# EAGLE schematic DUT-28bit-preCounter (EAGLE 5.07)
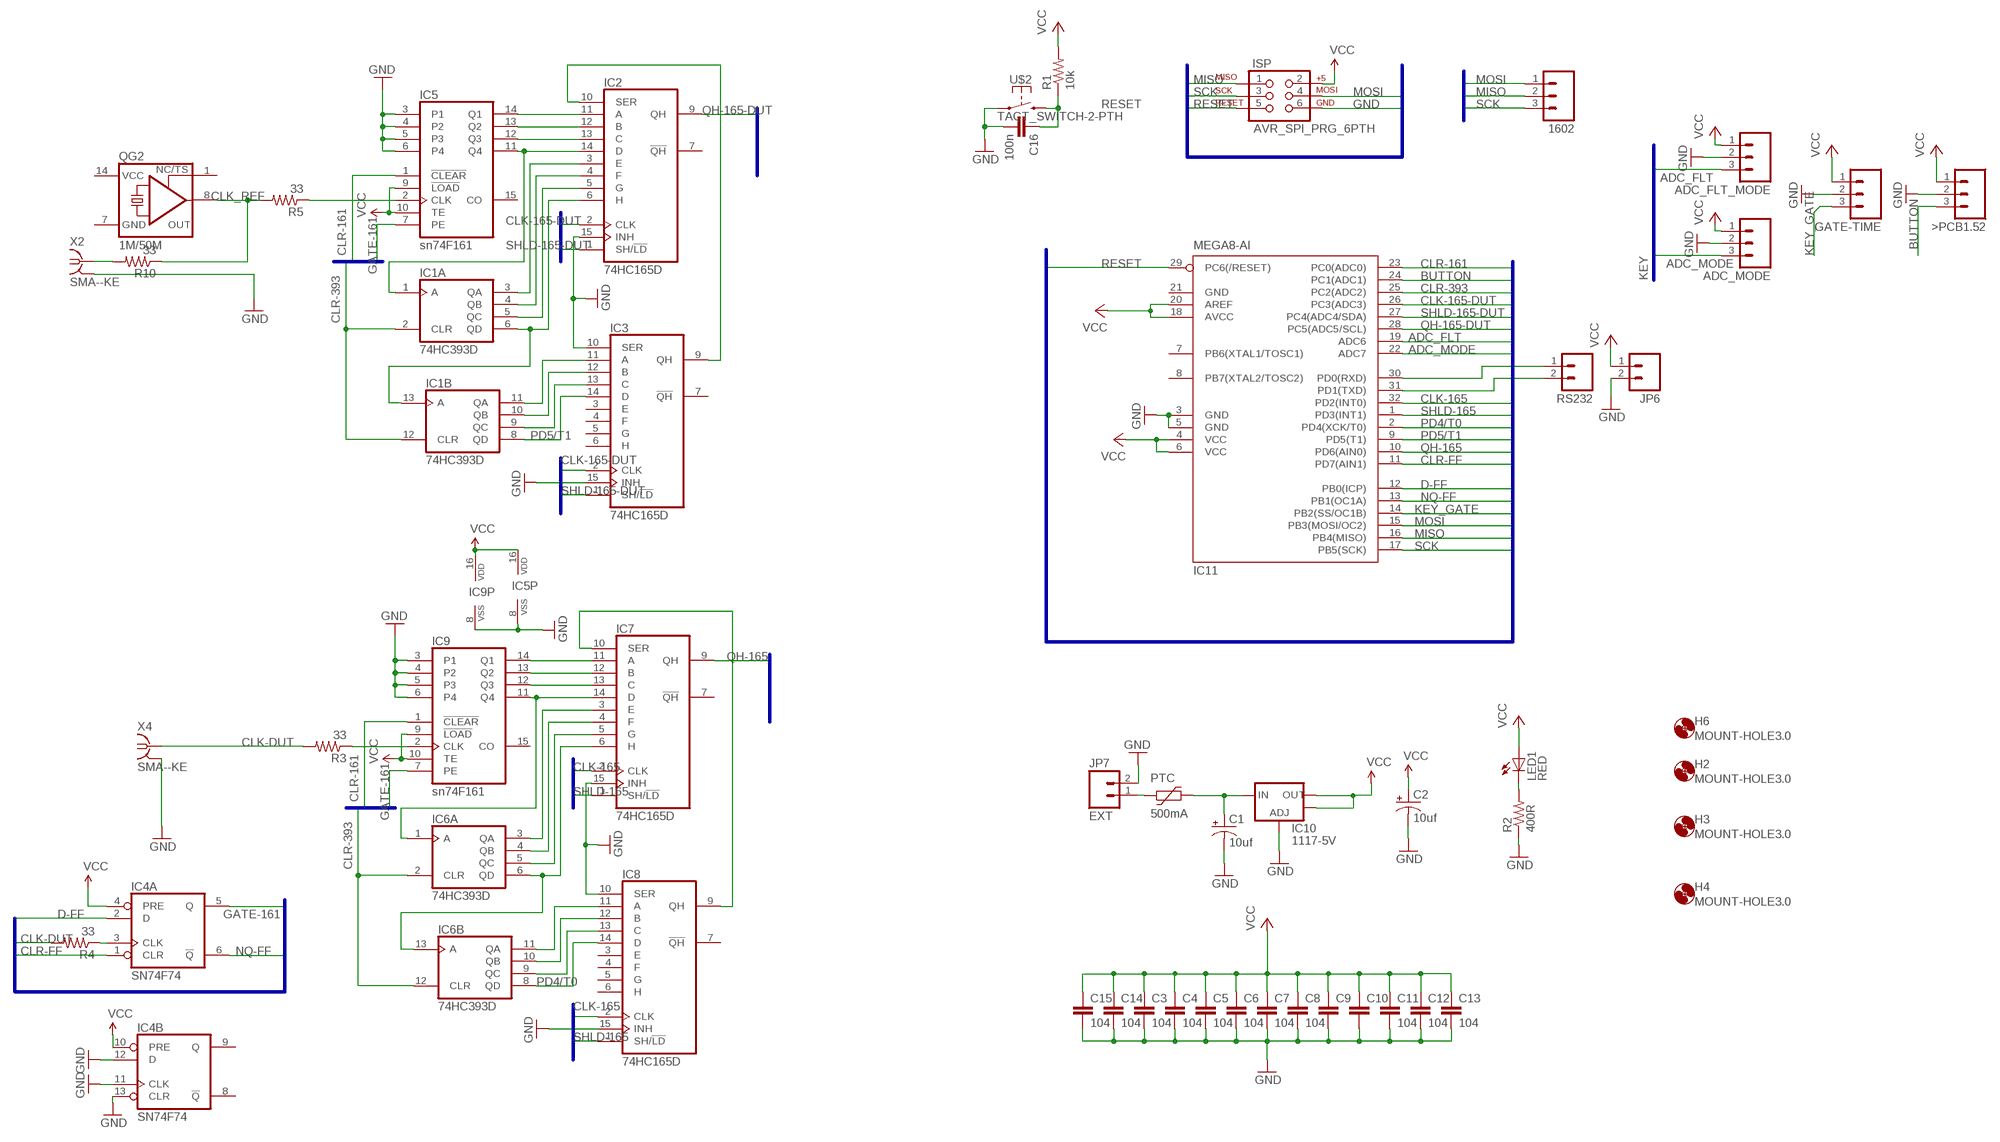
[diagram p0: schematic, sheet 1]

## Parts
1602  M03LOCK_LONGPADS  [1X03_LOCK_LONGPADS]
>PCB1.52  M03PTH  [1X03]
ADC_FLT_MODE  M03PTH  [1X03]
ADC_MODE  M03PTH  [1X03]
C1  10uf  CAP_POL7343  [EIA7343]
C2  10uf  CAP_POL7343  [EIA7343]
C3  104  CAP-C0805K  [C0805K]
C4  104  CAP-C0805K  [C0805K]
C5  104  CAP-C0805K  [C0805K]
C6  104  CAP-C0805K  [C0805K]
C7  104  CAP-C0805K  [C0805K]
C8  104  CAP-C0805K  [C0805K]
C9  CAP-C0805K  [C0805K]
C10  CAP-C0805K  [C0805K]
C11  104  CAP-C0805K  [C0805K]
C12  104  CAP-C0805K  [C0805K]
C13  104  CAP-C0805K  [C0805K]
C14  104  CAP-C0805K  [C0805K]
C15  104  CAP-C0805K  [C0805K]
C16  100n  CAP-C0805K  [C0805K]
GATE-TIME  M03PTH  [1X03]
H2  MOUNT-HOLE3.0  [3,0]
H3  MOUNT-HOLE3.0  [3,0]
H4  MOUNT-HOLE3.0  [3,0]
H6  MOUNT-HOLE3.0  [3,0]
IC1  74HC393D  [SO14]
IC2  74HC165D  [SO16]
IC3  74HC165D  [SO16]
IC4  SN74F74  74HC74D  [SO14]
IC5  sn74F161  4161D  [SO16]
IC6  74HC393D  [SO14]
IC7  74HC165D  [SO16]
IC8  74HC165D  [SO16]
IC9  sn74F161  4161D  [SO16]
IC10  1117-5V  V_REG_LM1117SOT223  [SOT223]
IC11  MEGA8-AI  [TQFP32-08]
ISP  AVR_SPI_PRG_6PTH  [2X3]
JP6  CON-02PTH  [1X02]
JP7  EXT  CON-02-XH  [XH-1X2-LONG-LOCK]
LED1  RED  LEDCHIP-LED0805  [CHIP-LED0805]
PTC  500mA  PTC-FUSE1812L  [1812L]
QG2  1M/50M  XO-14  [DIL14S]
R1  10k  RESISTOR0805  [0805]
R2  400R  RESISTOR0805  [0805]
R3  33  RESISTOR0805  [0805]
R4  33  RESISTOR0805  [0805]
R5  33  RESISTOR0805  [0805]
R10  33  RESISTOR0805  [0805]
RS232  CON-02PTH  [1X02]
U$2  TACT_SWITCH-2-PTH  [ALPS-SKHV]
X2  SMA--KE  [SMA-KE]
X4  SMA--KE  [SMA-KE]

## Nets
ADC_FLT: ADC_FLT_MODE.3 IC11.19(ADC6)
ADC_MODE: ADC_MODE.3 IC11.22(ADC7)
BUTTON: >PCB1.52.3 IC11.24(PC1(ADC1))
CLK-165: IC7.2(CLK) IC8.2(CLK) IC11.32(PD2(INT0))
CLK-165-DUT: IC2.2(CLK) IC3.2(CLK) IC11.26(PC3(ADC3))
CLK-DUT: R3.2 R4.2 X4.1
CLK_REF: QG2.8(OUT) R5.2 R10.1
CLR-161: IC5.1(!CLEAR) IC9.1(!CLEAR) IC11.23(PC0(ADC0))
CLR-393: IC1.2(A:CLR) IC1.12(B:CLR) IC6.2(A:CLR) IC6.12(B:CLR) IC11.25(PC2(ADC2))
CLR-FF: IC4.1(A:CLR) IC11.11(PD7(AIN1))
D-FF: IC4.2(A:D) IC11.12(PB0(ICP))
GATE-161: IC4.5(A:Q) IC5.7(PE) IC9.7(PE)
GND: >PCB1.52.2 ADC_FLT_MODE.2 ADC_MODE.2 C1.C(-) C2.C(-) C3.2 C4.2 C5.2 C6.2 C7.2 C8.2 C9.2 C10.2 C11.2 C12.2 C13.2 C14.2 C15.2 C16.2 GATE-TIME.2 IC2.15(INH) IC3.10(SER) IC3.15(INH) IC4.11(B:CLK) IC4.12(B:D) IC4.13(B:CLR) IC5.3(P1) IC5.4(P2) IC5.5(P3) IC5.6(P4) IC5.8(VSS) IC7.15(INH) IC8.10(SER) IC8.15(INH) IC9.3(P1) IC9.4(P2) IC9.5(P3) IC9.6(P4) IC9.8(VSS) IC10.1(ADJ) IC11.3(GND) IC11.5(GND) ISP.6 JP6.2 JP7.2 R2.1 U$2.2 X2.G@1(GND) X4.G@1(GND)
KEY_GATE: GATE-TIME.3 IC11.14(PB2(SS/OC1B))
MISO: 1602.2 IC11.16(PB4(MISO)) ISP.1
MOSI: 1602.1 IC11.15(PB3(MOSI/OC2)) ISP.4
N$1: IC2.11(A) IC5.14(Q1)
N$2: IC2.12(B) IC5.13(Q2)
N$3: IC2.13(C) IC5.12(Q3)
N$4: JP7.1 PTC.P$1
N$5: IC1.3(A:QA) IC2.3(E)
N$6: IC1.4(A:QB) IC2.4(F)
N$7: IC1.5(A:QC) IC2.5(G)
N$8: IC1.6(A:QD) IC1.13(B:A) IC2.6(H)
N$9: IC1.1(A:A) IC2.14(D) IC5.11(Q4)
N$10: IC1.11(B:QA) IC3.11(A)
N$11: IC1.10(B:QB) IC3.12(B)
N$12: IC1.9(B:QC) IC3.13(C)
N$13: IC11.30(PD0(RXD)) RS232.1
N$14: C1.A(+) IC10.3(IN) PTC.P$2
N$15: IC2.10(SER) IC3.9(QH)
N$16: IC7.11(A) IC9.14(Q1)
N$17: IC7.12(B) IC9.13(Q2)
N$18: IC7.13(C) IC9.12(Q3)
N$19: R10.2 X2.1
N$20: IC6.3(A:QA) IC7.3(E)
N$21: IC6.4(A:QB) IC7.4(F)
N$22: IC6.5(A:QC) IC7.5(G)
N$23: IC6.6(A:QD) IC6.13(B:A) IC7.6(H)
N$24: IC6.11(B:QA) IC8.11(A)
N$25: IC6.10(B:QB) IC8.12(B)
N$26: IC6.9(B:QC) IC8.13(C)
N$27: IC11.31(PD1(TXD)) RS232.2
N$28: IC6.1(A:A) IC7.14(D) IC9.11(Q4)
N$29: IC4.3(A:CLK) R4.1
N$30: IC7.10(SER) IC8.9(QH)
N$31: IC9.2(CLK) R3.1
N$32: LED1.C R2.2
N$45: IC5.2(CLK) R5.1
NQ-FF: IC4.6(A:!Q) IC11.13(PB1(OC1A))
PD4/T0: IC6.8(B:QD) IC8.14(D) IC11.2(PD4(XCK/T0))
PD5/T1: IC1.8(B:QD) IC3.14(D) IC11.9(PD5(T1))
QH-165: IC7.9(QH) IC11.10(PD6(AIN0))
QH-165-DUT: IC2.9(QH) IC11.28(PC5(ADC5/SCL))
RESET: C16.1 IC11.29(PC6(/RESET)) ISP.5 R1.1 U$2.3
SCK: 1602.3 IC11.17(PB5(SCK)) ISP.3
SHLD-165: IC7.1(SH/!LD) IC8.1(SH/!LD) IC11.1(PD3(INT1))
SHLD-165-DUT: IC2.1(SH/!LD) IC3.1(SH/!LD) IC11.27(PC4(ADC4/SDA))
VCC: >PCB1.52.1 ADC_FLT_MODE.1 ADC_MODE.1 C2.A(+) C3.1 C4.1 C5.1 C6.1 C7.1 C8.1 C9.1 C10.1 C11.1 C12.1 C13.1 C14.1 C15.1 GATE-TIME.1 IC4.4(A:PRE) IC4.10(B:PRE) IC5.9(!LOAD) IC5.10(TE) IC5.16(VDD) IC9.9(!LOAD) IC9.10(TE) IC9.16(VDD) IC10.2(OUT) IC10.4(OUT) IC11.4(VCC) IC11.6(VCC) IC11.18(AVCC) IC11.20(AREF) ISP.2 JP6.1 LED1.A R1.2
Unconnected: IC2.7(!QH) IC3.3(E) IC3.4(F) IC3.5(G) IC3.6(H) IC3.7(!QH) IC4.8(B:!Q) IC4.9(B:Q) IC5.15(CO) IC7.7(!QH) IC8.3(E) IC8.4(F) IC8.5(G) IC8.6(H) IC8.7(!QH) IC9.15(CO) IC11.7(PB6(XTAL1/TOSC1)) IC11.8(PB7(XTAL2/TOSC2)) QG2.1(TS)

## Buses
MEGA-BUS
KEY

## Power pins joined to a net without a drawn wire
GND: IC1.7(P:GND) IC2.8(GND) IC3.8(GND) IC4.7(P:GND) IC6.7(P:GND) IC7.8(GND) IC8.8(GND) IC11.21(GND) QG2.7(GND) X2.G@2(GND) X2.G@3(GND) X2.G@4(GND) X4.G@2(GND) X4.G@3(GND) X4.G@4(GND)
VCC: IC1.14(P:VCC) IC2.16(VCC) IC3.16(VCC) IC4.14(P:VCC) IC6.14(P:VCC) IC7.16(VCC) IC8.16(VCC) QG2.14(VCC)

## Library data of the parts
1602 >PCB1.52 ADC_FLT_MODE ADC_MODE GATE-TIME = SparkFun:M03: Header 3 Standard 3-pin 0.1" header. Use with straight break away headers (SKU : PRT-00116), right angle break away headers (PRT-00553), swiss pins (PRT-00743), machine pins (PRT-00117), and female headers (PRT-00115). Molex polarized connector foot print use with SKU : PRT-08232 with associated crimp pins and housings.
C1 C2 = digital-toy:CAP_POL: Capacitor Polarized These are standard SMD and PTH capacitors. Normally 10uF, 47uF, and 100uF in electrolytic and tantalum varieties. Always verify the external diameter of the through hole cap, it varies with capacity, voltage, and manufacturer. The EIA devices should be standard. PANASONIC_D size: 6.5mmx6.5mmx5.5mm, 100uf (taobao:6.3mmx5.5mm), same as CVL0605 153cvl0405 size: 4mmx4mmx5.5mm, 10uf (taobao:4mmx5.5mm) ct6032 typical 47uF Tantalum, comment by hyl.
C3-C16 = digital-toy:CAP: Capacitor Standard 0603 ceramic capacitor, and 0.1" leaded capacitor.
H2-H4 H6 = holes:MOUNT-HOLE: MOUNTING HOLE with drill center marker
IC1 IC6 = 74xx-eu:74*393: Dual 4-bit decade and binary COUNTER
IC2 IC3 IC7 IC8 = 74xx-eu:74*165: 8-bit parallel load SHIFT REGISTER
IC4 = 74xx-eu:74*74: Dual D type positive edge triggered FLIP FLOP, preset and clear
IC5 IC9 = 40xx:4161: Synchronous presettable 4-bit binary COUNTER
IC10 = SparkFun:V_REG_LM1117: Voltage Regulator LM1117 Standard adjustable voltage regulator but in SMD form. Spark Fun Electronics SKU : COM-00595
IC11 = atmel:MEGA8: MICROCONTROLLER 8 Kbytes FLASH, 1 kbytes SRAM, 512 bytes EEPROM, USART, 6-channel 10 bit ADC, 2-channel 8 bit ADC Pin compatible with Atmega48, ATMega88, ATMega168 Source: avr.lbr
ISP = SparkFun:AVR_SPI_PRG_6: AVR ISP 6 Pin This is the reduced ISP connector for AVR programming. Common on Arduino. This footprint will take up less PCB space and can be used with a 10-pin to 6-pin adapter such as SKU: BOB-08508
JP6 JP7 RS232 = digital-toy:CON-02: Header 2 Standard 2-pin 0.1" header. Use with straight break away headers (SKU : PRT-00116), right angle break away headers (PRT-00553), swiss pins (PRT-00743), machine pins (PRT-00117), and female headers (PRT-00115). Molex polarized connector foot print use with SKU : PRT-08233 with associated crimp pins and housings.
LED1 = led:LED: LED OSRAM: - CHIPLED LG R971, LG N971, LY N971, LG Q971, LY Q971, LO R971, LY R971 LH N974, LH R974 LS Q976, LO Q976, LY Q976 LO Q996 - Hyper CHIPLED LW Q18S LB Q993, LB Q99A, LB R99A - SideLED LS A670, LO A670, LY A670, LG A670, LP A670 LB A673, LV A673, LT A673, LW A673 LH A674 LY A675 LS A676, LA A676, LO A676, LY A676, LW A676 LS A679, LY A679, LG A679 - Hyper Micro SIDELED® LS Y876, LA Y876, LO Y876, LY Y876 LT Y87S - SmartLED LW L88C, LW L88S LB L89C, LB L89S, LG L890 LS L89K, LO L89K, LY L89K LS L896, LA L896, LO L896, LY L896 - TOPLED LS T670, LO T670, LY T670, LG T670, LP T670 LSG T670, LSP T670, LSY T670, LOP T670, LYG T670 LG T671, LOG T671, LSG T671 LB T673, LV T673, LT T673, LW T673 LH T674 LS T676, LA T676, LO T676, LY T676, LB T676, LH T676, LSB T676, LW T676 LB T67C, LV T67C, LT T67C, LS T67K, LO T67K, LY T67K, LW E67C LS E67B, LA E67B, LO E67B, LY E67B, LB E67C, LV E67C, LT E67C LW T67C LS T679, LY T679, LG T679 LS T770, LO T770, LY T770, LG T770, LP T770 LB T773, LV T773, LT T773, LW T773 LH T774 LS E675, LA E675, LY E675, LS T675 LS T776, LA T776, LO T776, LY T776, LB T776 LHGB T686 LT T68C, LB T68C - Hyper Mini TOPLED® LB M676 - Mini TOPLED Santana® LG M470 LS M47K, LO M47K, LY M47K Source: http://www.osram.convergy.de LUXEON: - LUMILED® LXK2-PW12-R00, LXK2-PW12-S00, LXK2-PW14-U00, LXK2-PW14-V00 LXK2-PM12-R00, LXK2-PM12-S00, LXK2-PM14-U00 LXK2-PE12-Q00, LXK2-PE12-R00, LXK2-PE12-S00, LXK2-PE14-T00, LXK2-PE14-U00 LXK2-PB12-K00, LXK2-PB12-L00, LXK2-PB12-M00, LXK2-PB14-N00, LXK2-PB14-P00, LXK2-PB14-Q00 LXK2-PR12-L00, LXK2-PR12-M00, LXK2-PR14-Q00, LXK2-PR14-R00 LXK2-PD12-Q00, LXK2-PD12-R00, LXK2-PD12-S00 LXK2-PH12-R00, LXK2-PH12-S00 LXK2-PL12-P00, LXK2-PL12-Q00, LXK2-PL12-R00 Source: www.luxeon.com KINGBRIGHT: KA-3528ASYC Source: www.kingbright.com
PTC = digital-toy:PTC-FUSE
QG2 = digital-toy:XO-: CRYSTAL
R1-R5 R10 = digital-toy:RESISTOR: Resistor Basic schematic elements and footprints for 0603, 1206, and PTH 1/10th watt (small) resistors. digital-toy copy vertical mount of axial-0.3 from rcl.lbr : the 0207/xx
U$2 = digital-toy:TACT_SWITCH-2
X2 X4 = dtoy-RF:SMA-: SMA 50 Ohm End Launch Jack Receptacle - Round Contact Johnson Components Source: www.johnsoncomponents.com .. J502-ND.pdf